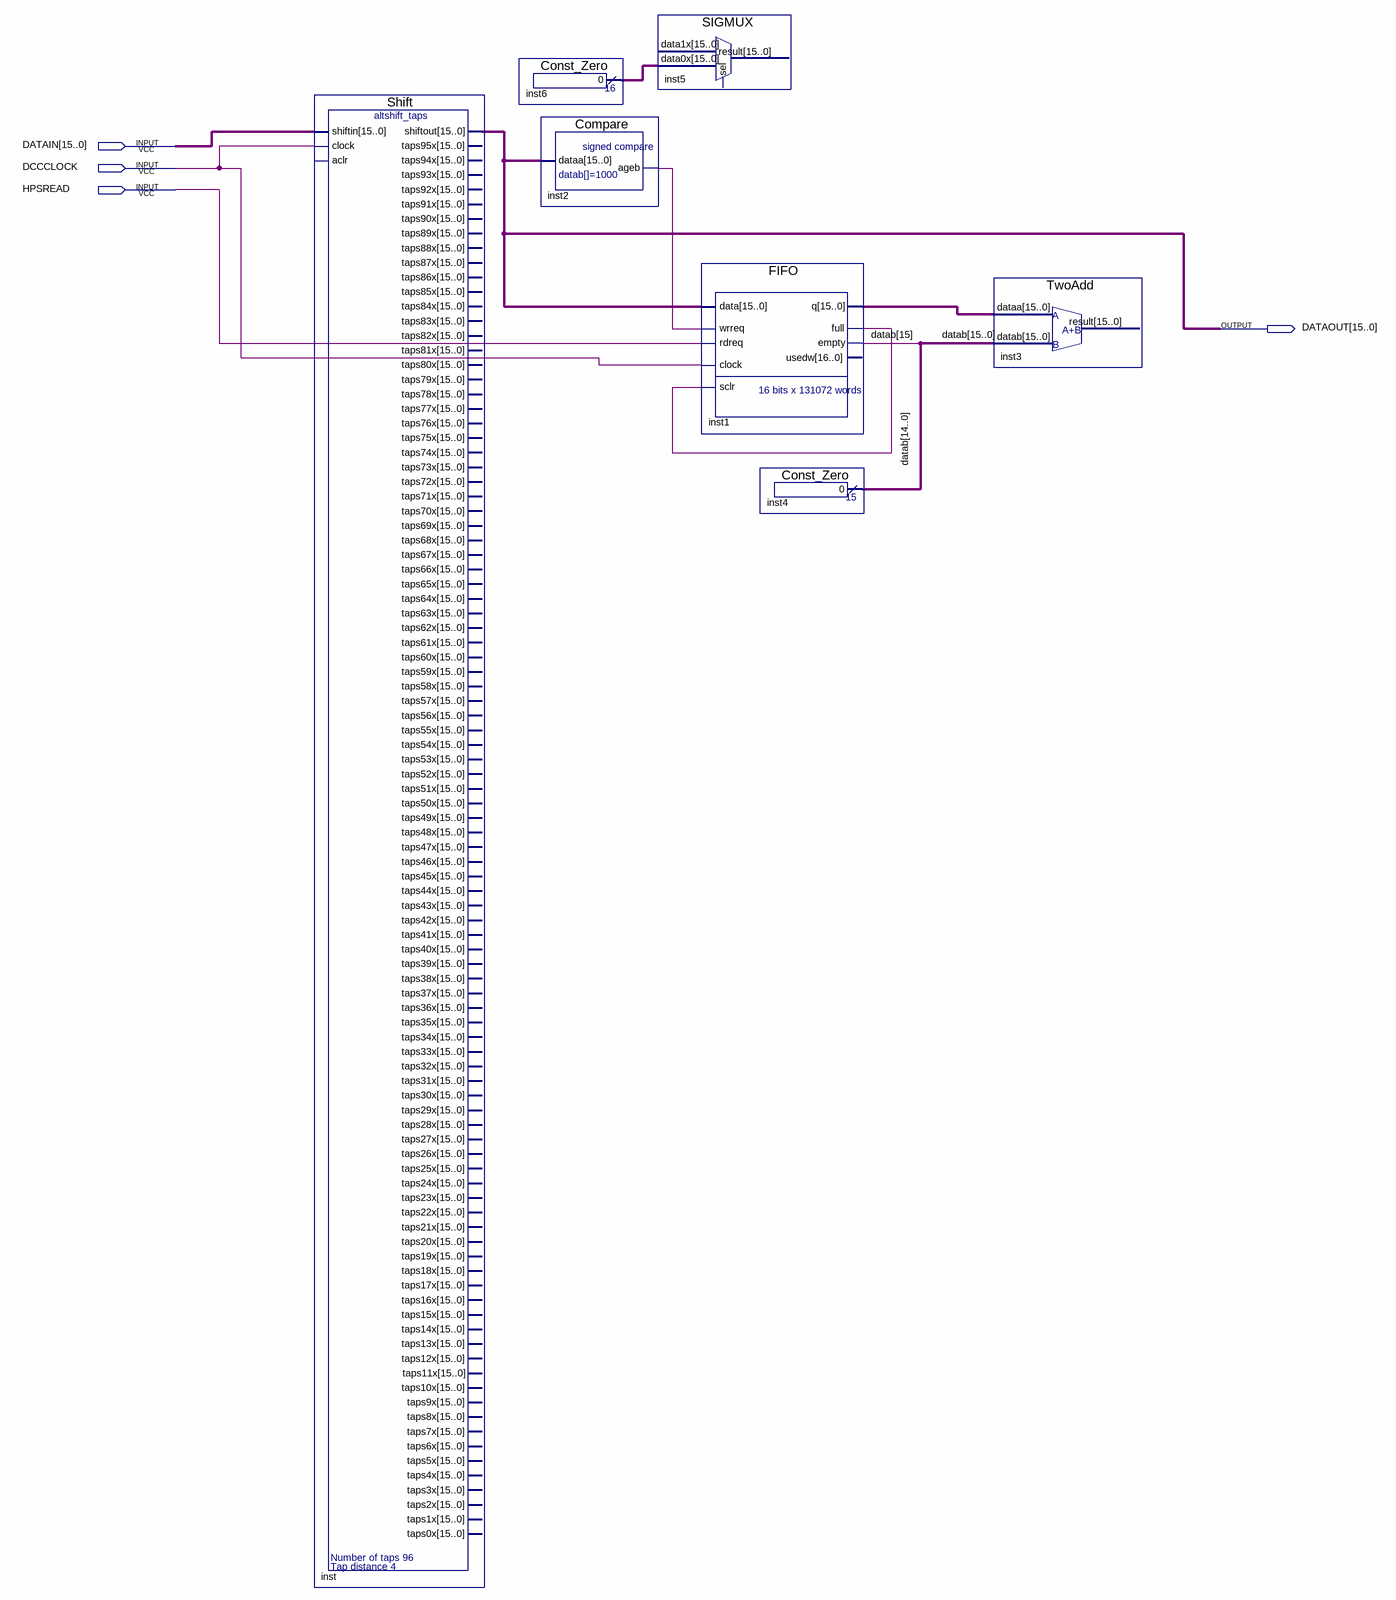
[diagram p0: schematic sheet]
// Quartus schematic FPGATOHPS.bdf as structural Verilog: 7 symbols, 4 pins
module FPGATOHPS (
  input  [15:0] DATAIN,
  input  DCCCLOCK,
  input  HPSREAD,
  output [15:0] DATAOUT
);

  wire inst1_full, inst2_ageb;
  wire [15:0] datab, inst1_q, inst6_result;

  Shift inst (
    .shiftin(DATAIN), .clock(DCCCLOCK), .shiftout(DATAOUT));  // open: aclr, taps95x, taps94x, taps93x, taps92x, taps91x, taps90x, taps89x, taps88x, taps87x, taps86x, taps85x, taps84x, taps83x, taps82x, taps81x, taps80x, taps79x, taps78x, taps77x, taps76x, taps75x, taps74x, taps73x, taps72x, taps71x, taps70x, taps69x, taps68x, taps67x, taps66x, taps65x, taps64x, taps63x, taps62x, taps61x, taps60x, taps59x, taps58x, taps57x, taps56x, taps55x, taps54x, taps53x, taps52x, taps51x, taps50x, taps49x, taps48x, taps47x, taps46x, taps45x, taps44x, taps43x, taps42x, taps41x, taps40x, taps39x, taps38x, taps37x, taps36x, taps35x, taps34x, taps33x, taps32x, taps31x, taps30x, taps29x, taps28x, taps27x, taps26x, taps25x, taps24x, taps23x, taps22x, taps21x, taps20x, taps19x, taps18x, taps17x, taps16x, taps15x, taps14x, taps13x, taps12x, taps11x, taps10x, taps9x, taps8x, taps7x, taps6x, taps5x, taps4x, taps3x, taps2x, taps1x, taps0x
  Const_Zero inst6 (.result(inst6_result));
  Compare inst2 (.dataa(DATAOUT), .ageb(inst2_ageb));
  SIGMUX inst5 (.data0x(inst6_result));  // open: data1x, sel, result
  FIFO inst1 (
    .data(DATAOUT), .wrreq(inst2_ageb), .rdreq(HPSREAD), .clock(DCCCLOCK), .sclr(inst1_full), .q(inst1_q),
    .full(inst1_full), .empty(datab[15]));  // open: usedw
  Const_Zero inst4 (.result(datab[14:0]));
  TwoAdd inst3 (.dataa(inst1_q), .datab(datab));  // open: result
endmodule
